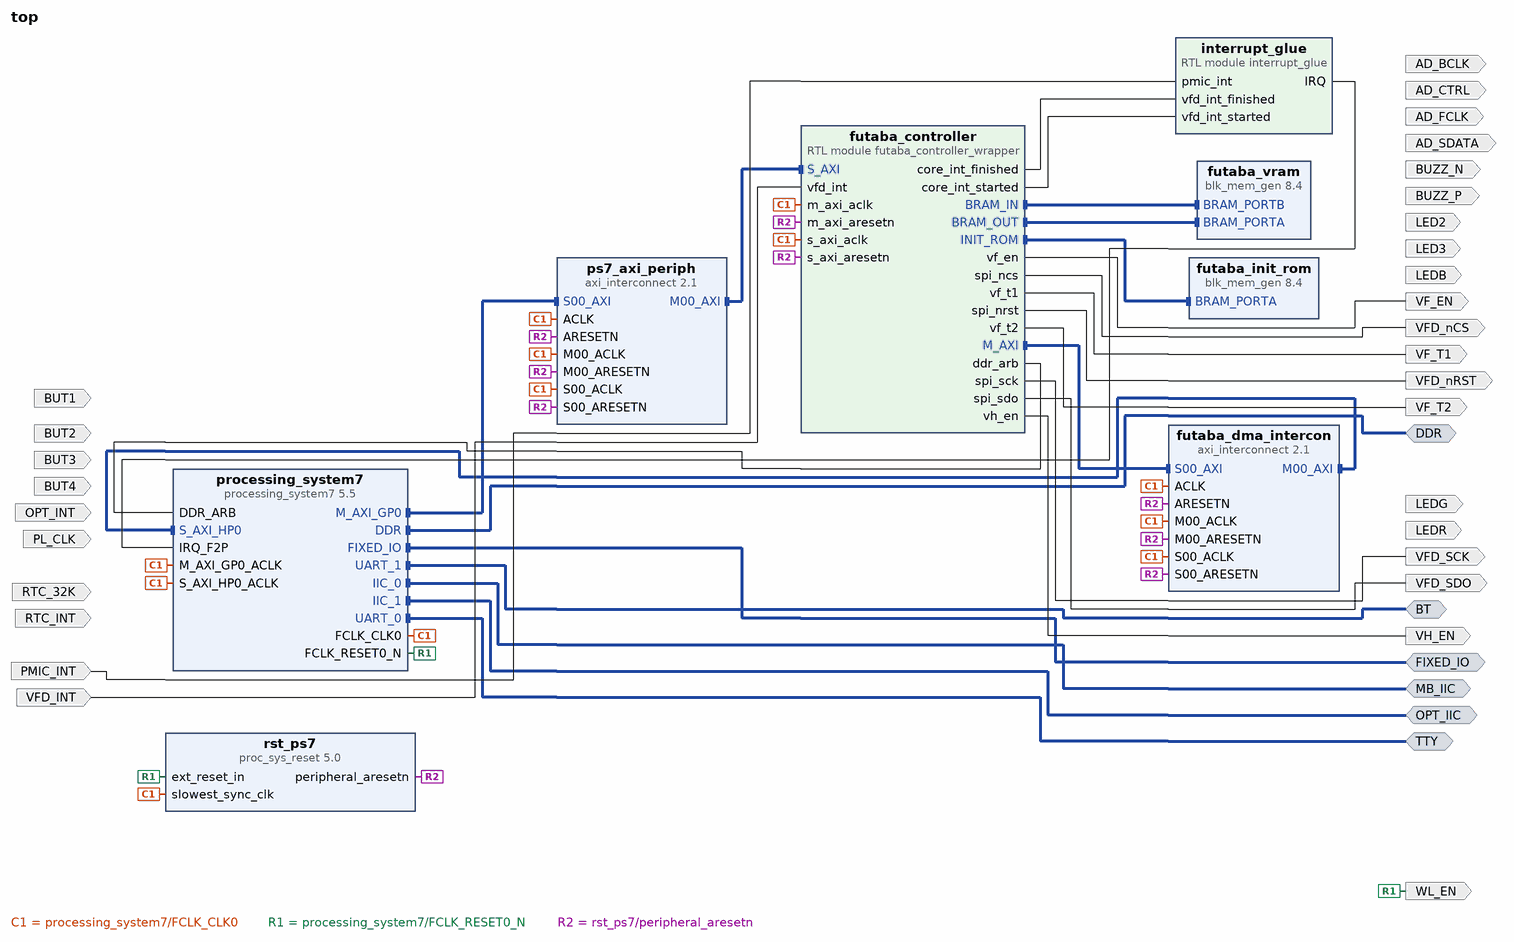
[diagram p0: block diagram of the top level]
# Vivado block design top, xc7z010clg400-1, Vivado 2023.1
create_bd_design top

create_bd_intf_port -mode Master -vlnv xilinx.com:interface:ddrx_rtl:1.0 DDR
create_bd_intf_port -mode Master -vlnv xilinx.com:display_processing_system7:fixedio_rtl:1.0 FIXED_IO
create_bd_intf_port -mode Master -vlnv xilinx.com:interface:uart_rtl:1.0 TTY
create_bd_intf_port -mode Master -vlnv xilinx.com:interface:uart_rtl:1.0 BT
create_bd_intf_port -mode Master -vlnv xilinx.com:interface:iic_rtl:1.0 MB_IIC
create_bd_intf_port -mode Master -vlnv xilinx.com:interface:iic_rtl:1.0 OPT_IIC
create_bd_port -dir I BUT1
create_bd_port -dir I BUT2
create_bd_port -dir I BUT3
create_bd_port -dir I BUT4
create_bd_port -dir I -type clk PL_CLK
set_property -dict {CONFIG.FREQ_HZ 50000000} [get_bd_ports PL_CLK]
create_bd_port -dir I -type clk RTC_INT
set_property -dict {CONFIG.FREQ_HZ 1} [get_bd_ports RTC_INT]
create_bd_port -dir I -type clk RTC_32K
set_property -dict {CONFIG.FREQ_HZ 32768} [get_bd_ports RTC_32K]
create_bd_port -dir O AD_BCLK
create_bd_port -dir O AD_CTRL
create_bd_port -dir O AD_FCLK
create_bd_port -dir O AD_SDATA
create_bd_port -dir O BUZZ_N
create_bd_port -dir O WL_EN
create_bd_port -dir O LEDR
create_bd_port -dir O LEDG
create_bd_port -dir O LEDB
create_bd_port -dir O LED2
create_bd_port -dir O LED3
create_bd_port -dir O BUZZ_P
create_bd_port -dir O VH_EN
create_bd_port -dir O VF_EN
create_bd_port -dir O VF_T1
create_bd_port -dir O VF_T2
create_bd_port -dir O VFD_nRST
create_bd_port -dir O VFD_nCS
create_bd_port -dir O VFD_SCK
create_bd_port -dir O VFD_SDO
create_bd_port -dir I -type intr OPT_INT
set_property -dict {CONFIG.SENSITIVITY EDGE_FALLING} [get_bd_ports OPT_INT]
create_bd_port -dir I -type intr PMIC_INT
set_property -dict {CONFIG.SENSITIVITY LEVEL_LOW} [get_bd_ports PMIC_INT]
create_bd_port -dir I -type intr VFD_INT
set_property -dict {CONFIG.SENSITIVITY EDGE_RISING} [get_bd_ports VFD_INT]

create_bd_cell -type ip -vlnv xilinx.com:ip:processing_system7:5.5 processing_system7
set_property -dict [list \
  CONFIG.PCW_FPGA0_PERIPHERAL_FREQMHZ 100 \
  CONFIG.PCW_GPIO_EMIO_GPIO_ENABLE 1 \
  CONFIG.PCW_GPIO_EMIO_GPIO_IO 5 \
  CONFIG.PCW_GPIO_EMIO_GPIO_WIDTH 5 \
  CONFIG.PCW_I2C0_I2C0_IO EMIO \
  CONFIG.PCW_I2C0_PERIPHERAL_ENABLE 1 \
  CONFIG.PCW_I2C1_I2C1_IO EMIO \
  CONFIG.PCW_I2C1_PERIPHERAL_ENABLE 1 \
  CONFIG.PCW_I2C_PERIPHERAL_FREQMHZ 111.111115 \
  CONFIG.PCW_IRQ_F2P_INTR 1 \
  CONFIG.PCW_SD0_GRP_CD_ENABLE 0 \
  CONFIG.PCW_SD0_GRP_WP_ENABLE 0 \
  CONFIG.PCW_SD0_PERIPHERAL_ENABLE 1 \
  CONFIG.PCW_SD0_SD0_IO {MIO 40 .. 45} \
  CONFIG.PCW_SD1_PERIPHERAL_ENABLE 1 \
  CONFIG.PCW_SD1_SD1_IO {MIO 46 .. 51} \
  CONFIG.PCW_SDIO_PERIPHERAL_FREQMHZ 50 \
  CONFIG.PCW_UART0_PERIPHERAL_ENABLE 1 \
  CONFIG.PCW_UART0_UART0_IO EMIO \
  CONFIG.PCW_UART1_PERIPHERAL_ENABLE 1 \
  CONFIG.PCW_UART1_UART1_IO EMIO \
  CONFIG.PCW_UART_PERIPHERAL_FREQMHZ 100 \
  CONFIG.PCW_UIPARAM_DDR_BUS_WIDTH {16 Bit} \
  CONFIG.PCW_UIPARAM_DDR_MEMORY_TYPE {DDR 3 (Low Voltage)} \
  CONFIG.PCW_UIPARAM_DDR_PARTNO Custom \
  CONFIG.PCW_USB0_PERIPHERAL_ENABLE 1 \
  CONFIG.PCW_USB0_USB0_IO {MIO 28 .. 39} \
  CONFIG.PCW_USE_DDR_BYPASS 1 \
  CONFIG.PCW_USE_FABRIC_INTERRUPT 1 \
  CONFIG.PCW_USE_S_AXI_HP0 1 \
] [get_bd_cells processing_system7]
# 148 more settings of processing_system7 are not shown: defaults, MIO pin electricals, DDR timing, and values the tool derives
create_bd_cell -type ip -vlnv xilinx.com:ip:blk_mem_gen:8.4 futaba_init_rom
set_property -dict [list \
  CONFIG.Algorithm Minimum_Area \
  CONFIG.Coe_File ../../../../new/futaba_init_rom.coe \
  CONFIG.Enable_A Always_Enabled \
  CONFIG.Fill_Remaining_Memory_Locations true \
  CONFIG.Load_Init_File true \
  CONFIG.Memory_Type Single_Port_ROM \
  CONFIG.Write_Depth_A 32 \
  CONFIG.Write_Width_A 10 \
  CONFIG.use_bram_block Stand_Alone \
] [get_bd_cells futaba_init_rom]
create_bd_cell -type ip -vlnv xilinx.com:ip:blk_mem_gen:8.4 futaba_vram
set_property -dict [list \
  CONFIG.Algorithm Minimum_Area \
  CONFIG.Assume_Synchronous_Clk true \
  CONFIG.Enable_A Always_Enabled \
  CONFIG.Enable_B Always_Enabled \
  CONFIG.Fill_Remaining_Memory_Locations true \
  CONFIG.Memory_Type Simple_Dual_Port_RAM \
  CONFIG.Write_Depth_A 32 \
  CONFIG.Write_Width_A 64 \
  CONFIG.Write_Width_B 64 \
  CONFIG.ecctype No_ECC \
  CONFIG.use_bram_block Stand_Alone \
] [get_bd_cells futaba_vram]
create_bd_cell -type ip -vlnv xilinx.com:ip:axi_interconnect:2.1 ps7_axi_periph
set_property -dict {CONFIG.NUM_MI 1} [get_bd_cells ps7_axi_periph]
create_bd_cell -type ip -vlnv xilinx.com:ip:proc_sys_reset:5.0 rst_ps7
create_bd_cell -type ip -vlnv xilinx.com:ip:axi_interconnect:2.1 futaba_dma_intercon
set_property -dict {CONFIG.NUM_MI 1} [get_bd_cells futaba_dma_intercon]
create_bd_cell -type module -reference interrupt_glue interrupt_glue
create_bd_cell -type module -reference futaba_controller_wrapper futaba_controller

# ---- connections ----

connect_bd_intf_net -intf_net axi_mem_intercon_M00_AXI [get_bd_intf_pins futaba_dma_intercon/M00_AXI] [get_bd_intf_pins processing_system7/S_AXI_HP0]
connect_bd_intf_net -intf_net futaba_controller_wr_0_BRAM_IN [get_bd_intf_pins futaba_controller/BRAM_IN] [get_bd_intf_pins futaba_vram/BRAM_PORTB]
connect_bd_intf_net -intf_net futaba_controller_wr_0_BRAM_OUT [get_bd_intf_pins futaba_controller/BRAM_OUT] [get_bd_intf_pins futaba_vram/BRAM_PORTA]
connect_bd_intf_net -intf_net futaba_controller_wr_0_INIT_ROM [get_bd_intf_pins futaba_controller/INIT_ROM] [get_bd_intf_pins futaba_init_rom/BRAM_PORTA]
connect_bd_intf_net -intf_net futaba_controller_wr_0_M_AXI [get_bd_intf_pins futaba_controller/M_AXI] [get_bd_intf_pins futaba_dma_intercon/S00_AXI]
connect_bd_intf_net -intf_net processing_system7_0_DDR [get_bd_intf_ports DDR] [get_bd_intf_pins processing_system7/DDR]
connect_bd_intf_net -intf_net processing_system7_0_FIXED_IO [get_bd_intf_ports FIXED_IO] [get_bd_intf_pins processing_system7/FIXED_IO]
connect_bd_intf_net -intf_net processing_system7_0_IIC_0 [get_bd_intf_ports MB_IIC] [get_bd_intf_pins processing_system7/IIC_0]
connect_bd_intf_net -intf_net processing_system7_0_IIC_1 [get_bd_intf_ports OPT_IIC] [get_bd_intf_pins processing_system7/IIC_1]
connect_bd_intf_net -intf_net processing_system7_0_M_AXI_GP0 [get_bd_intf_pins processing_system7/M_AXI_GP0] [get_bd_intf_pins ps7_axi_periph/S00_AXI]
connect_bd_intf_net -intf_net processing_system7_0_UART_0 [get_bd_intf_ports TTY] [get_bd_intf_pins processing_system7/UART_0]
connect_bd_intf_net -intf_net processing_system7_0_UART_1 [get_bd_intf_ports BT] [get_bd_intf_pins processing_system7/UART_1]
connect_bd_intf_net [get_bd_intf_pins ps7_axi_periph/M00_AXI] [get_bd_intf_pins futaba_controller/S_AXI]
connect_bd_net [get_bd_ports PMIC_INT] [get_bd_pins interrupt_glue/pmic_int]
connect_bd_net [get_bd_ports VFD_INT] [get_bd_pins futaba_controller/vfd_int]
connect_bd_net [get_bd_pins futaba_controller/core_int_finished] [get_bd_pins interrupt_glue/vfd_int_finished]
connect_bd_net [get_bd_pins futaba_controller/core_int_started] [get_bd_pins interrupt_glue/vfd_int_started]
connect_bd_net -net futaba_controller_wr_0_ddr_arb [get_bd_pins futaba_controller/ddr_arb] [get_bd_pins processing_system7/DDR_ARB]
connect_bd_net -net futaba_controller_wr_0_spi_ncs [get_bd_pins futaba_controller/spi_ncs] [get_bd_ports VFD_nCS]
connect_bd_net -net futaba_controller_wr_0_spi_nrst [get_bd_pins futaba_controller/spi_nrst] [get_bd_ports VFD_nRST]
connect_bd_net -net futaba_controller_wr_0_spi_sck [get_bd_pins futaba_controller/spi_sck] [get_bd_ports VFD_SCK]
connect_bd_net -net futaba_controller_wr_0_spi_sdo [get_bd_pins futaba_controller/spi_sdo] [get_bd_ports VFD_SDO]
connect_bd_net -net futaba_controller_wr_0_vf_en [get_bd_pins futaba_controller/vf_en] [get_bd_ports VF_EN]
connect_bd_net -net futaba_controller_wr_0_vf_t1 [get_bd_pins futaba_controller/vf_t1] [get_bd_ports VF_T1]
connect_bd_net -net futaba_controller_wr_0_vf_t2 [get_bd_pins futaba_controller/vf_t2] [get_bd_ports VF_T2]
connect_bd_net -net futaba_controller_wr_0_vh_en [get_bd_pins futaba_controller/vh_en] [get_bd_ports VH_EN]
connect_bd_net -net interrupt_glue_0_IRQ [get_bd_pins interrupt_glue/IRQ] [get_bd_pins processing_system7/IRQ_F2P]
connect_bd_net -net processing_system7_0_FCLK_CLK0 [get_bd_pins processing_system7/FCLK_CLK0] \
  [get_bd_pins processing_system7/M_AXI_GP0_ACLK] [get_bd_pins ps7_axi_periph/S00_ACLK] \
  [get_bd_pins rst_ps7/slowest_sync_clk] [get_bd_pins ps7_axi_periph/M00_ACLK] [get_bd_pins ps7_axi_periph/ACLK] \
  [get_bd_pins futaba_dma_intercon/S00_ACLK] [get_bd_pins processing_system7/S_AXI_HP0_ACLK] \
  [get_bd_pins futaba_dma_intercon/M00_ACLK] [get_bd_pins futaba_dma_intercon/ACLK] \
  [get_bd_pins futaba_controller/s_axi_aclk] [get_bd_pins futaba_controller/m_axi_aclk]
connect_bd_net -net processing_system7_0_FCLK_RESET0_N [get_bd_pins processing_system7/FCLK_RESET0_N] \
  [get_bd_pins rst_ps7/ext_reset_in] [get_bd_ports WL_EN]
connect_bd_net -net rst_ps7_0_200M_peripheral_aresetn [get_bd_pins rst_ps7/peripheral_aresetn] \
  [get_bd_pins ps7_axi_periph/S00_ARESETN] [get_bd_pins ps7_axi_periph/M00_ARESETN] [get_bd_pins ps7_axi_periph/ARESETN] \
  [get_bd_pins futaba_dma_intercon/S00_ARESETN] [get_bd_pins futaba_dma_intercon/M00_ARESETN] \
  [get_bd_pins futaba_dma_intercon/ARESETN] [get_bd_pins futaba_controller/s_axi_aresetn] \
  [get_bd_pins futaba_controller/m_axi_aresetn]

# ---- address map ----
assign_bd_address -offset 0x00000000 -range 512M -target_address_space [get_bd_addr_spaces futaba_controller/M_AXI] [get_bd_addr_segs processing_system7/S_AXI_HP0/HP0_DDR_LOWOCM]
assign_bd_address -offset 0x40000000 -range 256 -target_address_space [get_bd_addr_spaces processing_system7/Data] [get_bd_addr_segs futaba_controller/S_AXI/reg0]

validate_bd_design
save_bd_design
